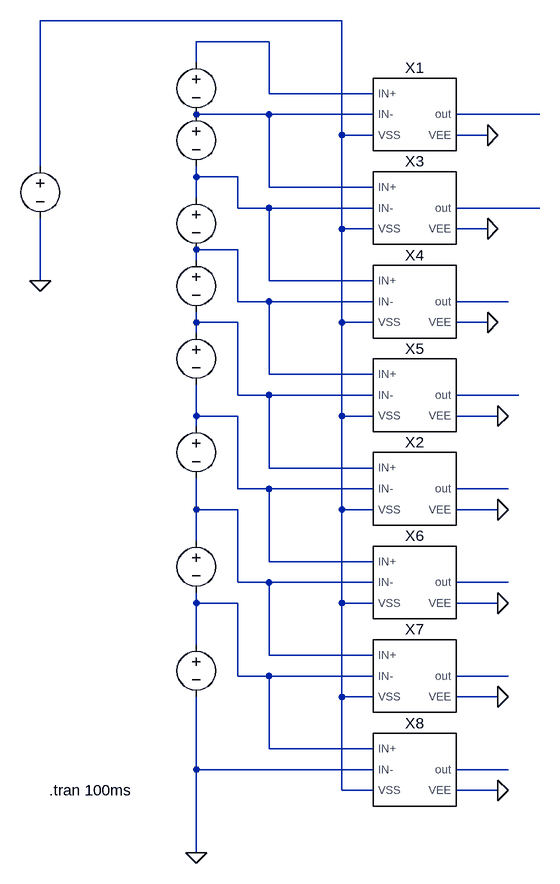
[diagram p0: schematic voltmod_main.asc]
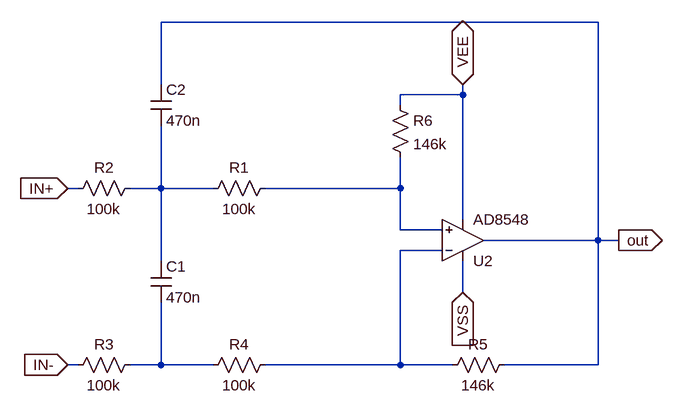
[diagram p1: sub-circuit voltmod_op.asc]
voltmod_main.asc, the LTspice schematic file:
Version 4
SHEET 1 880 1204
WIRE -96 -96 -560 -96
WIRE -208 -64 -320 -64
WIRE -320 -32 -320 -64
WIRE -208 16 -208 -64
WIRE -48 16 -208 16
WIRE -208 48 -320 48
WIRE -48 48 -208 48
WIRE 208 48 80 48
WIRE -96 80 -96 -96
WIRE -48 80 -96 80
WIRE 128 80 80 80
WIRE -560 128 -560 -96
WIRE -320 144 -320 128
WIRE -256 144 -320 144
WIRE -208 160 -208 48
WIRE -48 160 -208 160
WIRE -320 176 -320 144
WIRE -256 192 -256 144
WIRE -208 192 -256 192
WIRE -48 192 -208 192
WIRE 208 192 80 192
WIRE -96 224 -96 80
WIRE -48 224 -96 224
WIRE 128 224 80 224
WIRE -256 256 -320 256
WIRE -320 272 -320 256
WIRE -560 304 -560 208
WIRE -208 304 -208 192
WIRE -48 304 -208 304
WIRE -256 336 -256 256
WIRE -208 336 -256 336
WIRE -48 336 -208 336
WIRE 160 336 80 336
WIRE -320 368 -320 352
WIRE -256 368 -320 368
WIRE -96 368 -96 224
WIRE -48 368 -96 368
WIRE 128 368 80 368
WIRE -320 384 -320 368
WIRE -208 448 -208 336
WIRE -48 448 -208 448
WIRE -256 480 -256 368
WIRE -208 480 -256 480
WIRE -48 480 -208 480
WIRE 176 480 80 480
WIRE -320 512 -320 464
WIRE -256 512 -320 512
WIRE -96 512 -96 368
WIRE -48 512 -96 512
WIRE 144 512 80 512
WIRE -320 528 -320 512
WIRE -208 592 -208 480
WIRE -48 592 -208 592
WIRE -256 624 -256 512
WIRE -208 624 -256 624
WIRE -48 624 -208 624
WIRE 160 624 80 624
WIRE -320 656 -320 608
WIRE -256 656 -320 656
WIRE -96 656 -96 512
WIRE -48 656 -96 656
WIRE 144 656 80 656
WIRE -320 704 -320 656
WIRE -208 736 -208 624
WIRE -48 736 -208 736
WIRE -256 768 -256 656
WIRE -208 768 -256 768
WIRE -48 768 -208 768
WIRE 160 768 80 768
WIRE -320 800 -320 784
WIRE -256 800 -320 800
WIRE -96 800 -96 656
WIRE -48 800 -96 800
WIRE 144 800 80 800
WIRE -320 864 -320 800
WIRE -208 880 -208 768
WIRE -48 880 -208 880
WIRE -256 912 -256 800
WIRE -208 912 -256 912
WIRE -48 912 -208 912
WIRE 160 912 80 912
WIRE -96 944 -96 800
WIRE -48 944 -96 944
WIRE 144 944 80 944
WIRE -208 1024 -208 912
WIRE -48 1024 -208 1024
WIRE -320 1056 -320 944
WIRE -48 1056 -320 1056
WIRE 160 1056 80 1056
WIRE -96 1088 -96 944
WIRE -48 1088 -96 1088
WIRE 144 1088 80 1088
WIRE -320 1184 -320 1056
FLAG -320 1184 0
FLAG 144 656 0
FLAG 128 224 0
FLAG 128 80 0
FLAG 128 368 0
FLAG 144 512 0
FLAG 144 800 0
FLAG 144 944 0
FLAG 144 1088 0
FLAG -560 304 0
SYMBOL voltage -320 -48 R0
WINDOW 0 24 16 Invisible 2
WINDOW 3 24 96 Invisible 2
WINDOW 123 0 0 Left 0
WINDOW 39 0 0 Left 0
SYMATTR InstName V1
SYMATTR Value 4.5
SYMBOL voltage -320 32 R0
WINDOW 0 24 16 Invisible 2
WINDOW 3 24 96 Invisible 2
WINDOW 123 0 0 Left 0
WINDOW 39 0 0 Left 0
SYMATTR InstName V2
SYMATTR Value 4.5
SYMBOL voltage -320 160 R0
WINDOW 0 24 16 Invisible 2
WINDOW 3 24 96 Invisible 2
WINDOW 123 0 0 Left 0
WINDOW 39 0 0 Left 0
SYMATTR InstName V3
SYMATTR Value 4.5
SYMBOL voltage -320 256 R0
WINDOW 0 24 16 Invisible 2
WINDOW 3 24 96 Invisible 2
WINDOW 123 0 0 Left 0
WINDOW 39 0 0 Left 0
SYMATTR InstName V4
SYMATTR Value 4.5
SYMBOL voltage -320 368 R0
WINDOW 0 24 16 Invisible 2
WINDOW 3 24 96 Invisible 2
WINDOW 123 0 0 Left 0
WINDOW 39 0 0 Left 0
SYMATTR InstName V5
SYMATTR Value 4.5
SYMBOL voltage -320 688 R0
WINDOW 0 24 16 Invisible 2
WINDOW 3 24 96 Invisible 2
WINDOW 123 0 0 Left 0
WINDOW 39 0 0 Left 0
SYMATTR InstName V7
SYMATTR Value 4.5
SYMBOL voltage -320 848 R0
WINDOW 0 24 16 Invisible 2
WINDOW 3 24 96 Invisible 2
WINDOW 123 0 0 Left 0
WINDOW 39 0 0 Left 0
SYMATTR InstName V8
SYMATTR Value 4.5
SYMBOL voltmod_op 16 48 R0
SYMATTR InstName X1
SYMBOL voltmod_op 16 624 R0
SYMATTR InstName X2
SYMBOL voltmod_op 16 192 R0
SYMATTR InstName X3
SYMBOL voltmod_op 16 336 R0
SYMATTR InstName X4
SYMBOL voltmod_op 16 480 R0
SYMATTR InstName X5
SYMBOL voltmod_op 16 768 R0
SYMATTR InstName X6
SYMBOL voltmod_op 16 912 R0
SYMATTR InstName X7
SYMBOL voltmod_op 16 1056 R0
SYMATTR InstName X8
SYMBOL voltage -320 512 R0
WINDOW 0 24 16 Invisible 2
WINDOW 3 24 96 Invisible 2
WINDOW 123 0 0 Left 0
WINDOW 39 0 0 Left 0
SYMATTR InstName V9
SYMATTR Value SINE(4 100m 60k)
SYMBOL voltage -560 112 R0
WINDOW 0 24 16 Invisible 2
WINDOW 3 24 96 Invisible 2
WINDOW 123 0 0 Left 0
WINDOW 39 0 0 Left 0
SYMATTR InstName V6
SYMATTR Value 36
TEXT -546 1088 Left 2 !.tran 100ms

voltmod_op.asc, the sub-circuit schematic file:
Version 4
SHEET 1 880 680
WIRE 640 -176 -32 -176
WIRE -32 -80 -32 -176
WIRE 432 -64 432 -80
WIRE 432 -64 336 -64
WIRE 336 -48 336 -64
WIRE -160 80 -176 80
WIRE -32 80 -32 -16
WIRE -32 80 -80 80
WIRE 48 80 -32 80
WIRE 336 80 336 32
WIRE 336 80 128 80
WIRE 432 128 432 -64
WIRE 336 144 336 80
WIRE 400 144 336 144
WIRE 640 160 640 -176
WIRE 640 160 464 160
WIRE 672 160 640 160
WIRE 400 176 336 176
WIRE -32 192 -32 80
WIRE 432 240 432 192
WIRE -160 352 -176 352
WIRE -32 352 -32 256
WIRE -32 352 -80 352
WIRE 48 352 -32 352
WIRE 336 352 336 176
WIRE 336 352 128 352
WIRE 416 352 336 352
WIRE 640 352 640 160
WIRE 640 352 496 352
FLAG 432 -80 VEE
IOPIN 432 -80 BiDir
FLAG 432 240 VSS
IOPIN 432 240 In
FLAG -176 80 IN+
IOPIN -176 80 In
FLAG -176 352 IN-
IOPIN -176 352 In
FLAG 672 160 out
IOPIN 672 160 Out
DATAFLAG 240 80 ""
SYMBOL res 144 336 R90
WINDOW 0 0 56 VBottom 2
WINDOW 3 32 56 VTop 2
SYMATTR InstName R4
SYMATTR Value 100k
SYMBOL cap -48 192 R0
SYMATTR InstName C1
SYMATTR Value 470n
SYMBOL res 512 336 R90
WINDOW 0 0 56 VBottom 2
WINDOW 3 32 56 VTop 2
SYMATTR InstName R5
SYMATTR Value 146k
SYMBOL res 144 64 R90
WINDOW 0 0 56 VBottom 2
WINDOW 3 32 56 VTop 2
SYMATTR InstName R1
SYMATTR Value 100k
SYMBOL res -64 64 R90
WINDOW 0 0 56 VBottom 2
WINDOW 3 32 56 VTop 2
SYMATTR InstName R2
SYMATTR Value 100k
SYMBOL res -64 336 R90
WINDOW 0 0 56 VBottom 2
WINDOW 3 32 56 VTop 2
SYMATTR InstName R3
SYMATTR Value 100k
SYMBOL cap -48 -80 R0
SYMATTR InstName C2
SYMATTR Value 470n
SYMBOL res 320 -64 R0
SYMATTR InstName R6
SYMATTR Value 146k
SYMBOL OpAmps\\AD8548 432 224 M180
SYMATTR InstName U2

The netlist it stands for:
* voltmod_main.asc
V1 N002 N003 4.5
V2 N003 N005 4.5
V3 N005 N007 4.5
V4 N007 N009 4.5
V5 N009 N011 4.5
V7 N013 N015 4.5
V8 N015 0 4.5
XX1 N002 N003 N001 0 N004 voltmod_op
XX2 N009 N011 N001 0 N012 voltmod_op
XX3 N003 N005 N001 0 N006 voltmod_op
XX4 N005 N007 N001 0 N008 voltmod_op
XX5 N007 N009 N001 0 N010 voltmod_op
XX6 N011 N013 N001 0 N014 voltmod_op
XX7 N013 N015 N001 0 N016 voltmod_op
XX8 N015 0 N001 0 N017 voltmod_op
V9 N011 N013 SINE(4 100m 60k)
V6 N001 0 36

* block symbol definitions
.subckt voltmod_op IN+ IN- VSS VEE out
R4 N003 N004 100k
C1 N001 N004 470n
R5 out N003 146k
R1 N002 N001 100k
R2 N001 IN+ 100k
R3 N004 IN- 100k
C2 out N001 470n
R6 VEE N002 146k
XU2 N002 N003 VSS VEE out AD8548  ; pins In+ In- V+ V- OUT
.ends voltmod_op

.tran 100ms
.backanno
.end